# Altium schematic sheet Top.SchDoc
size 304 x 254 mm
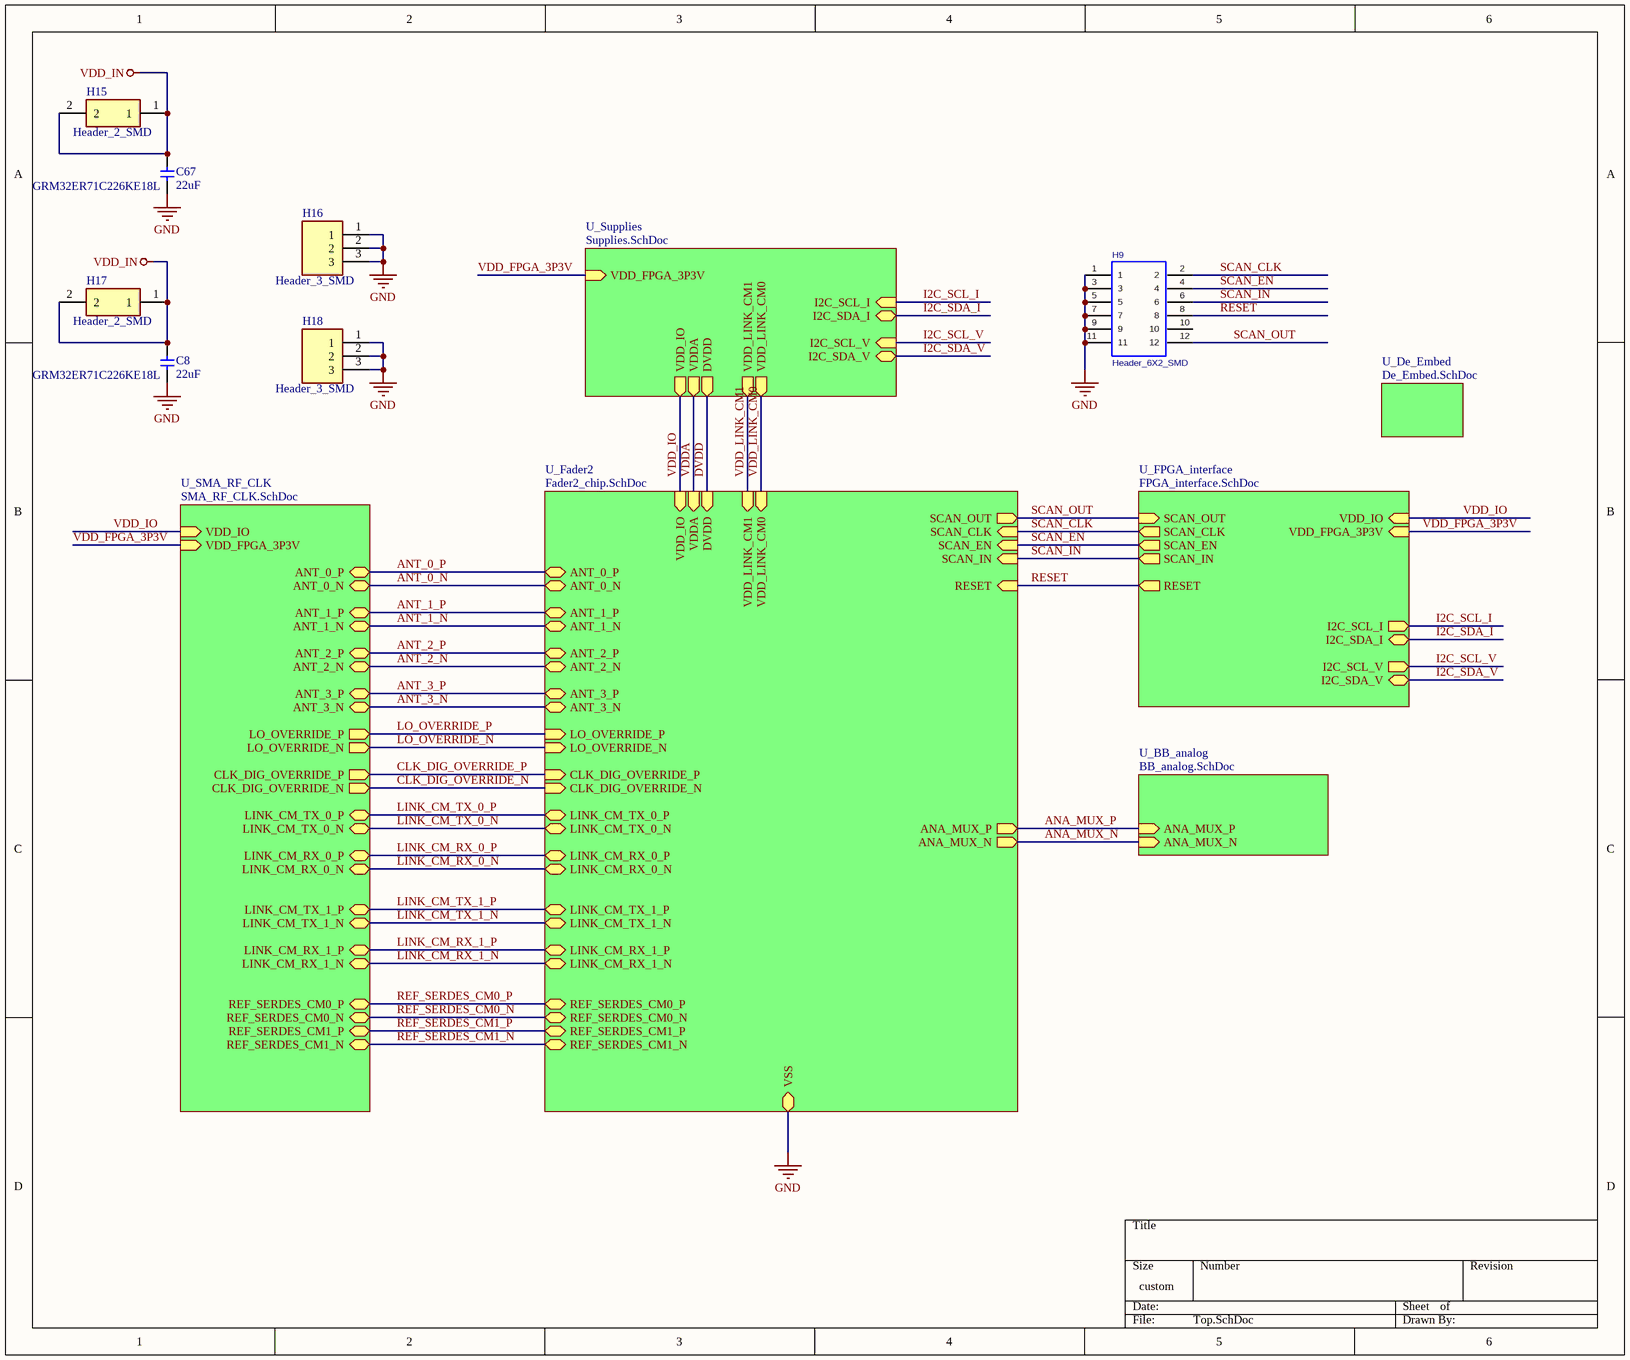
[diagram p0: Top.SchDoc]

## Parts
C8  22uF  Supplier Part Number 1: GRM32ER71C226KE18L  [CAPC3225X27N]
C67  22uF  Supplier Part Number 1: GRM32ER71C226KE18L  [CAPC3225X27N]
H9  Header_6X2_SMD  [HDR2X6_SMD]
H15  Header_2_SMD  [HDR1X2_SMD_S]
H16  Header_3_SMD  [HDR1X3_SMD]
H17  Header_2_SMD  [HDR1X2_SMD_S]
H18  Header_3_SMD  [HDR1X3_SMD]

## Sub-sheets
U_BB_analog = BB_analog.SchDoc: ANA_MUX_N (in), ANA_MUX_P (in)
U_De_Embed = De_Embed.SchDoc: no entries
U_Fader2 = Fader2_chip.SchDoc: VSS (bidir), SCAN_OUT (out), SCAN_CLK (in), SCAN_EN (in), SCAN_IN (in), ANT_2_N (bidir), LINK_CM_RX_0_N (bidir), LINK_CM_TX_0_P (bidir), LINK_CM_RX_0_P (bidir), RESET (in), LINK_CM_TX_0_N (bidir), ANT_1_N (bidir), ANT_2_P (bidir), ANT_3_N (bidir), ANT_0_P (bidir), ANT_3_P (bidir), ANT_1_P (bidir), ANT_0_N (bidir), CLK_DIG_OVERRIDE_P (in), LO_OVERRIDE_N (in), ANA_MUX_N (out), ANA_MUX_P (out), LO_OVERRIDE_P (in), CLK_DIG_OVERRIDE_N (in), DVDD (in), VDD_IO (in), VDDA (in), VDD_LINK_CM0 (in), VDD_LINK_CM1 (in), LINK_CM_TX_1_P (bidir), LINK_CM_TX_1_N (bidir), LINK_CM_RX_1_P (bidir), LINK_CM_RX_1_N (bidir), REF_SERDES_CM1_N (bidir), REF_SERDES_CM1_P (bidir), REF_SERDES_CM0_N (bidir), REF_SERDES_CM0_P (bidir)
U_FPGA_interface = FPGA_interface.SchDoc: I2C_SDA_I (bidir), I2C_SDA_V (bidir), VDD_FPGA_3P3V (in), VDD_IO (in), I2C_SCL_V (out), I2C_SCL_I (out), SCAN_OUT (in), RESET (out), SCAN_EN (out), SCAN_IN (out), SCAN_CLK (out)
U_SMA_RF_CLK = SMA_RF_CLK.SchDoc: LO_OVERRIDE_P (out), CLK_DIG_OVERRIDE_N (out), CLK_DIG_OVERRIDE_P (out), LO_OVERRIDE_N (out), VDD_IO (in), VDD_FPGA_3P3V (in), ANT_3_N (bidir), ANT_3_P (bidir), ANT_1_P (bidir), ANT_2_N (bidir), ANT_0_N (bidir), ANT_1_N (bidir), ANT_0_P (bidir), ANT_2_P (bidir), LINK_CM_RX_0_N (bidir), LINK_CM_RX_0_P (bidir), LINK_CM_TX_0_N (bidir), LINK_CM_TX_0_P (bidir), LINK_CM_RX_1_N (bidir), LINK_CM_RX_1_P (bidir), LINK_CM_TX_1_N (bidir), LINK_CM_TX_1_P (bidir), REF_SERDES_CM0_N (bidir), REF_SERDES_CM1_P (bidir), REF_SERDES_CM1_N (bidir), REF_SERDES_CM0_P (bidir)
U_Supplies = Supplies.SchDoc: I2C_SDA_I (bidir), I2C_SDA_V (bidir), VDD_FPGA_3P3V (in), DVDD (out), VDDA (out), VDD_IO (out), I2C_SCL_V (in), I2C_SCL_I (in), VDD_LINK_CM1 (out), VDD_LINK_CM0 (out)

## Nets
GND: C8.2 C67.2 H9.1 H9.3 H9.5 H9.7 H9.9 H9.11 H16.1 H16.2 H16.3 H18.1 H18.2 H18.3 ; sheet U_Fader2/VSS
VDD_IN: C8.1 C67.1 H15.1 H15.2 H17.1 H17.2
ANA_MUX_N: sheet U_Fader2/ANA_MUX_N, sheet U_BB_analog/ANA_MUX_N
ANA_MUX_P: sheet U_Fader2/ANA_MUX_P, sheet U_BB_analog/ANA_MUX_P
ANT_0_N: sheet U_Fader2/ANT_0_N, sheet U_SMA_RF_CLK/ANT_0_N
ANT_0_P: sheet U_Fader2/ANT_0_P, sheet U_SMA_RF_CLK/ANT_0_P
ANT_1_N: sheet U_Fader2/ANT_1_N, sheet U_SMA_RF_CLK/ANT_1_N
ANT_1_P: sheet U_Fader2/ANT_1_P, sheet U_SMA_RF_CLK/ANT_1_P
ANT_2_N: sheet U_Fader2/ANT_2_N, sheet U_SMA_RF_CLK/ANT_2_N
ANT_2_P: sheet U_Fader2/ANT_2_P, sheet U_SMA_RF_CLK/ANT_2_P
ANT_3_N: sheet U_Fader2/ANT_3_N, sheet U_SMA_RF_CLK/ANT_3_N
ANT_3_P: sheet U_Fader2/ANT_3_P, sheet U_SMA_RF_CLK/ANT_3_P
CLK_DIG_OVERRIDE_N: sheet U_Fader2/CLK_DIG_OVERRIDE_N, sheet U_SMA_RF_CLK/CLK_DIG_OVERRIDE_N
CLK_DIG_OVERRIDE_P: sheet U_Fader2/CLK_DIG_OVERRIDE_P, sheet U_SMA_RF_CLK/CLK_DIG_OVERRIDE_P
DVDD: sheet U_Fader2/DVDD, sheet U_Supplies/DVDD
I2C_SCL_I: sheet U_FPGA_interface/I2C_SCL_I, sheet U_Supplies/I2C_SCL_I
I2C_SCL_V: sheet U_FPGA_interface/I2C_SCL_V, sheet U_Supplies/I2C_SCL_V
I2C_SDA_I: sheet U_FPGA_interface/I2C_SDA_I, sheet U_Supplies/I2C_SDA_I
I2C_SDA_V: sheet U_FPGA_interface/I2C_SDA_V, sheet U_Supplies/I2C_SDA_V
LINK_CM_RX_0_N: sheet U_Fader2/LINK_CM_RX_0_N, sheet U_SMA_RF_CLK/LINK_CM_RX_0_N
LINK_CM_RX_0_P: sheet U_Fader2/LINK_CM_RX_0_P, sheet U_SMA_RF_CLK/LINK_CM_RX_0_P
LINK_CM_RX_1_N: sheet U_Fader2/LINK_CM_RX_1_N, sheet U_SMA_RF_CLK/LINK_CM_RX_1_N
LINK_CM_RX_1_P: sheet U_Fader2/LINK_CM_RX_1_P, sheet U_SMA_RF_CLK/LINK_CM_RX_1_P
LINK_CM_TX_0_N: sheet U_Fader2/LINK_CM_TX_0_N, sheet U_SMA_RF_CLK/LINK_CM_TX_0_N
LINK_CM_TX_0_P: sheet U_Fader2/LINK_CM_TX_0_P, sheet U_SMA_RF_CLK/LINK_CM_TX_0_P
LINK_CM_TX_1_N: sheet U_Fader2/LINK_CM_TX_1_N, sheet U_SMA_RF_CLK/LINK_CM_TX_1_N
LINK_CM_TX_1_P: sheet U_Fader2/LINK_CM_TX_1_P, sheet U_SMA_RF_CLK/LINK_CM_TX_1_P
LO_OVERRIDE_N: sheet U_Fader2/LO_OVERRIDE_N, sheet U_SMA_RF_CLK/LO_OVERRIDE_N
LO_OVERRIDE_P: sheet U_Fader2/LO_OVERRIDE_P, sheet U_SMA_RF_CLK/LO_OVERRIDE_P
REF_SERDES_CM0_N: sheet U_Fader2/REF_SERDES_CM0_N, sheet U_SMA_RF_CLK/REF_SERDES_CM0_N
REF_SERDES_CM0_P: sheet U_Fader2/REF_SERDES_CM0_P, sheet U_SMA_RF_CLK/REF_SERDES_CM0_P
REF_SERDES_CM1_N: sheet U_Fader2/REF_SERDES_CM1_N, sheet U_SMA_RF_CLK/REF_SERDES_CM1_N
REF_SERDES_CM1_P: sheet U_Fader2/REF_SERDES_CM1_P, sheet U_SMA_RF_CLK/REF_SERDES_CM1_P
RESET: H9.8 ; sheet U_Fader2/RESET, sheet U_FPGA_interface/RESET
SCAN_CLK: H9.2 ; sheet U_Fader2/SCAN_CLK, sheet U_FPGA_interface/SCAN_CLK
SCAN_EN: H9.4 ; sheet U_Fader2/SCAN_EN, sheet U_FPGA_interface/SCAN_EN
SCAN_IN: H9.6 ; sheet U_Fader2/SCAN_IN, sheet U_FPGA_interface/SCAN_IN
SCAN_OUT: H9.12 ; sheet U_Fader2/SCAN_OUT, sheet U_FPGA_interface/SCAN_OUT
VDD_FPGA_3P3V: sheet U_SMA_RF_CLK/VDD_FPGA_3P3V, sheet U_FPGA_interface/VDD_FPGA_3P3V, sheet U_Supplies/VDD_FPGA_3P3V
VDD_IO: sheet U_Fader2/VDD_IO, sheet U_SMA_RF_CLK/VDD_IO, sheet U_FPGA_interface/VDD_IO, sheet U_Supplies/VDD_IO
VDD_LINK_CM0: sheet U_Fader2/VDD_LINK_CM0, sheet U_Supplies/VDD_LINK_CM0
VDD_LINK_CM1: sheet U_Fader2/VDD_LINK_CM1, sheet U_Supplies/VDD_LINK_CM1
VDDA: sheet U_Fader2/VDDA, sheet U_Supplies/VDDA

Not connected (* = marked no-connect by the designer): H9 10

## Library data of the parts
C8 C67 = cap 22uF: CAP CER 22uF 10% 16V X7R 1210; Manufacturer: Murata; Manufacturer ID: GRM32ER71C226KE18L; Digikey ID: 490-4524-1-ND; Value: 22uF; Package: 1210; Supplier 1: Arrow
H9 = Header_6X2_SMD: Connector Header Vertical Dual Row, SMD, 12 position 0.100" (2.54mm); MANUFACTURER: SAMTEC; PCB DECAL: TSM-106-XX-XXX-DV; Supplier 1: Digi-Key; Supplier Part Number 1: SAM10803-ND; CREATED: November 23, 2017 - Wendy Xin
H15 H17 = Header_2_SMD: Connector Header Vertical, SMD, 2 position 0.100" (2.54mm); Manufacturer_Name: SAMTEC; Manufacturer_Part_Number: TSM-102-01-S-SV; Datasheet Link: https://componentsearchengine.com/Datasheets/2/TSM-102-01-S-SV.pdf; Arrow Part Number: TSM-102-01-S-SV; Arrow Price/Stock: https://www.arrow.com/en/products/tsm-102-01-s-sv/samtec; Mouser Part Number: 200-TSM10201SSV; Mouser Price/Stock: https://www.mouser.co.uk/ProductDetail/Samtec/TSM-102-01-S-SV?qs=FESYatJ8odJNSemiJZ%2Fyzw%3D%3D; Supplier 1: Digi-Key; Supplier Part Number 1: SAM10783-ND
H16 H18 = Header_3_SMD: Connector Header Vertical, SMD, 3 position 0.100" (2.54mm); Manufacturer_Name: SAMTEC; Manufacturer_Part_Number: TSM-103-01-S-SV-P-TR; Datasheet Link: http://suddendocs.samtec.com/prints/tsm-1xx-xx-xxx-sv-xx-xxx-xx-mkt.pdf; Height: 11.17mm; Arrow Part Number: TSM-103-01-S-SV-P-TR; Arrow Price/Stock: https://www.arrow.com/en/products/tsm-103-01-s-sv-p-tr/samtec; Mouser Part Number: 200-TSM10301SSVPTR; Mouser Price/Stock: https://www.mouser.co.uk/ProductDetail/Samtec/TSM-103-01-S-SV-P-TR?qs=FESYatJ8odJI6Ns4akqicQ%3D%3D; Supplier 1: Newark; Supplier 2: Digi-Key; Supplier Part Number 1: 80K8300; Supplier Part Number 2: SAM13283CT-ND